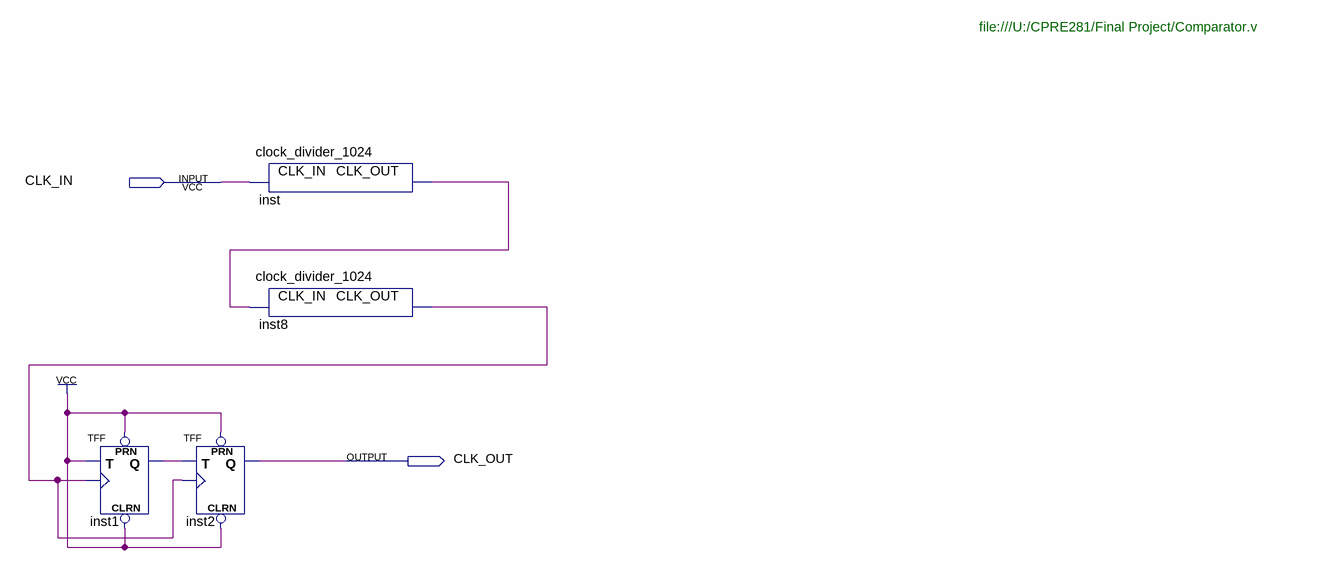
[diagram p0: schematic sheet]
// Quartus schematic clock_generator.bdf as structural Verilog: 4 symbols, 2 pins
module clock_generator (
  input  CLK_IN,
  output CLK_OUT
);

  wire inst1_q, inst8_clk_out, inst_clk_out;

  TFF inst1 (.PRN(1'b1), .CLRN(1'b1), .T(1'b1), .CLK(inst8_clk_out), .Q(inst1_q));
  clock_divider_1024 inst (.CLK_IN(CLK_IN), .CLK_OUT(inst_clk_out));
  clock_divider_1024 inst8 (.CLK_IN(inst_clk_out), .CLK_OUT(inst8_clk_out));
  TFF inst2 (.PRN(1'b1), .CLRN(1'b1), .T(inst1_q), .CLK(inst8_clk_out), .Q(CLK_OUT));

  // Notes on the sheet:
  //   file:///U:/CPRE281/Final Project/Comparator.v
endmodule
